# EAGLE schematic avr-adapter (EAGLE 7.5.0)
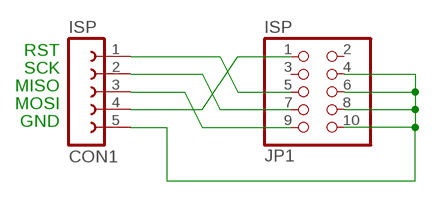
[diagram p0: schematic, sheet 1]

## Parts
CON1  ISP  FE05-1  [FE05-1]
JP1  ISP  PINHD-2X5  [2X05]

## Nets
N$6: CON1.1 JP1.5
N$7: CON1.2 JP1.7
N$8: CON1.3 JP1.9
N$9: CON1.4 JP1.1
N$10: CON1.5 JP1.4 JP1.6 JP1.8 JP1.10
Unconnected: JP1.2 JP1.3

## Notes on the sheet
- RST
- SCK
- MISO
- MOSI
- GND

## Library data of the parts
CON1 = con-lsta:FE05-1: FEMALE HEADER; OC_FARNELL: unknown; OC_NEWARK: unknown
JP1 = pinhead:PINHD-2X5: PIN HEADER